# Altium project Hammer.PrjPCB (part 3 of 3)
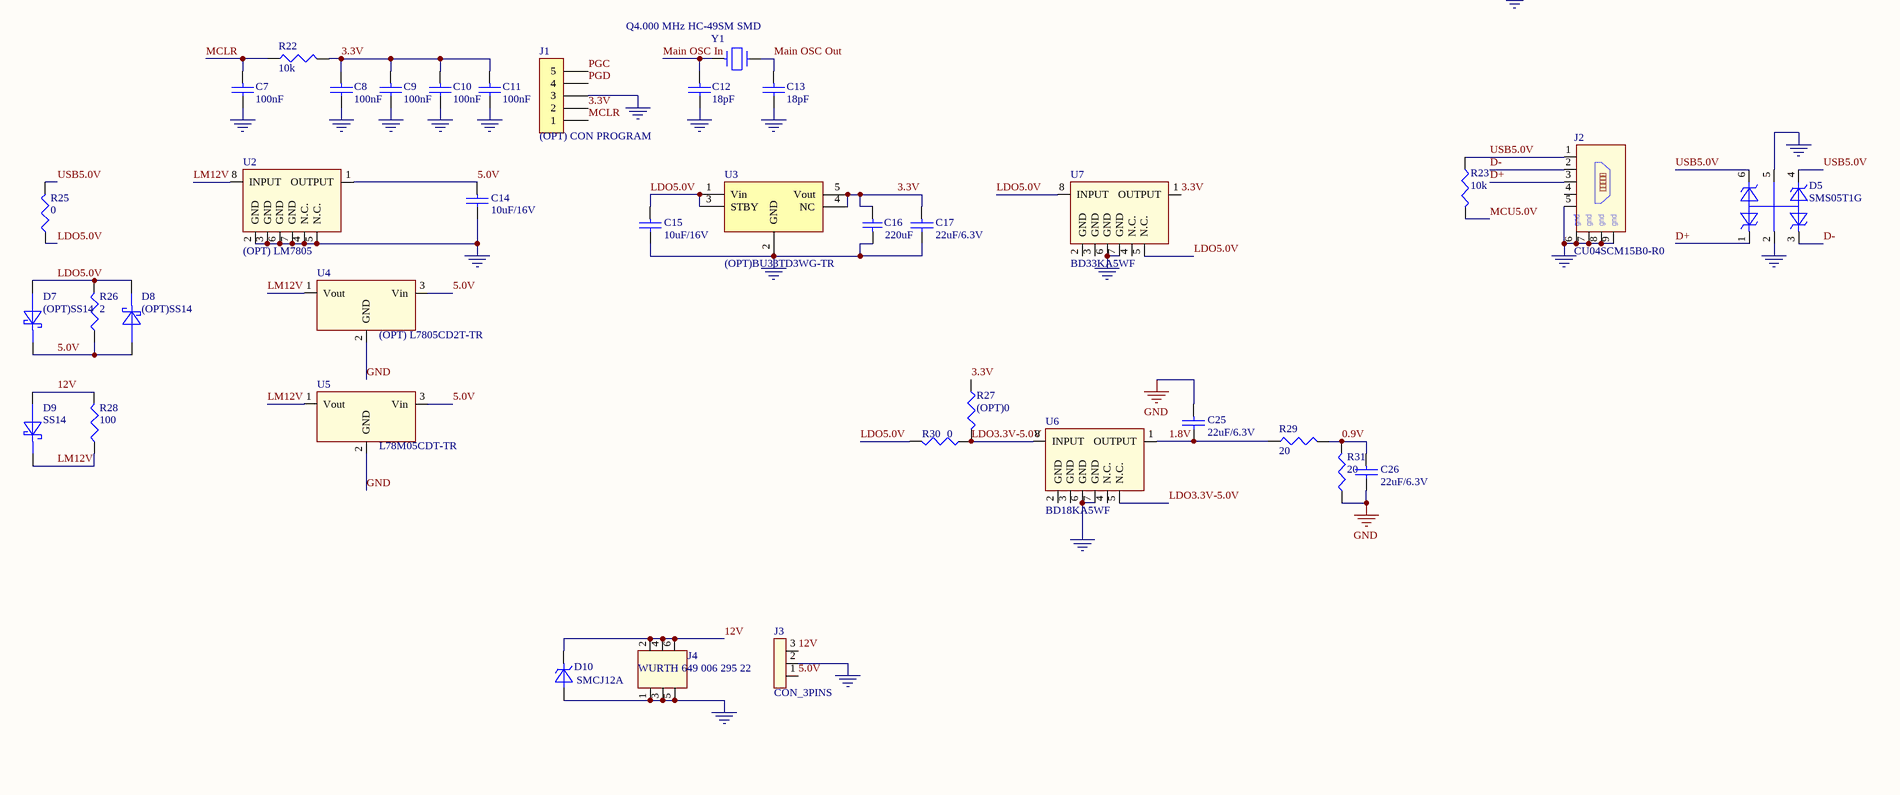
[diagram p7: Hammer.SchDoc, bottom right]

## Assembly variants
V1: not fitted C_220_1 C_220_2 C_220_3 C_220_4 C_220_5 C_220_6 C_220_7 C_220_8 C_220_9 C_220_10 C_220_11 C_220_12 C_220_13 C_220_14 C_220_15 C_220_16 C_220_17 C_220_18 C_220_19 C_220_20 C_220_21 C_220_22 C_220_23 C_220_24 C_220_25 C_220_26 C_220_27 C_220_28 C_220_29 C_220_30 C_220_31 C_220_32 C_220_33 C_220_34 C_220_35 C_220_36 C_220_37 C_220_38 C_220_39 C_220_40 C_220_41 C_220_42 C_220_43 C_220_44 C_220_45 C_220_46 C_220_47 C_220_48 C_220_49 C_220_50 C_220_51 C_220_52 C_220_53 C_220_54 C_220_55 C_220_56 C_220_57 C_220_58 C_220_59 C_220_60 C_220_61 C_220_62 C_220_63 C_220_64 C_220_65 C_220_66 C_220_67 C_220_68 C_220_69 C_220_70 C_220_71 C_220_73 D7 D8 J1 R19 R27 U2 U3 U4
V2 220uF ASIC: all parts fitted